# Altium schematic sheet ADC_Sheet.SchDoc
size A4
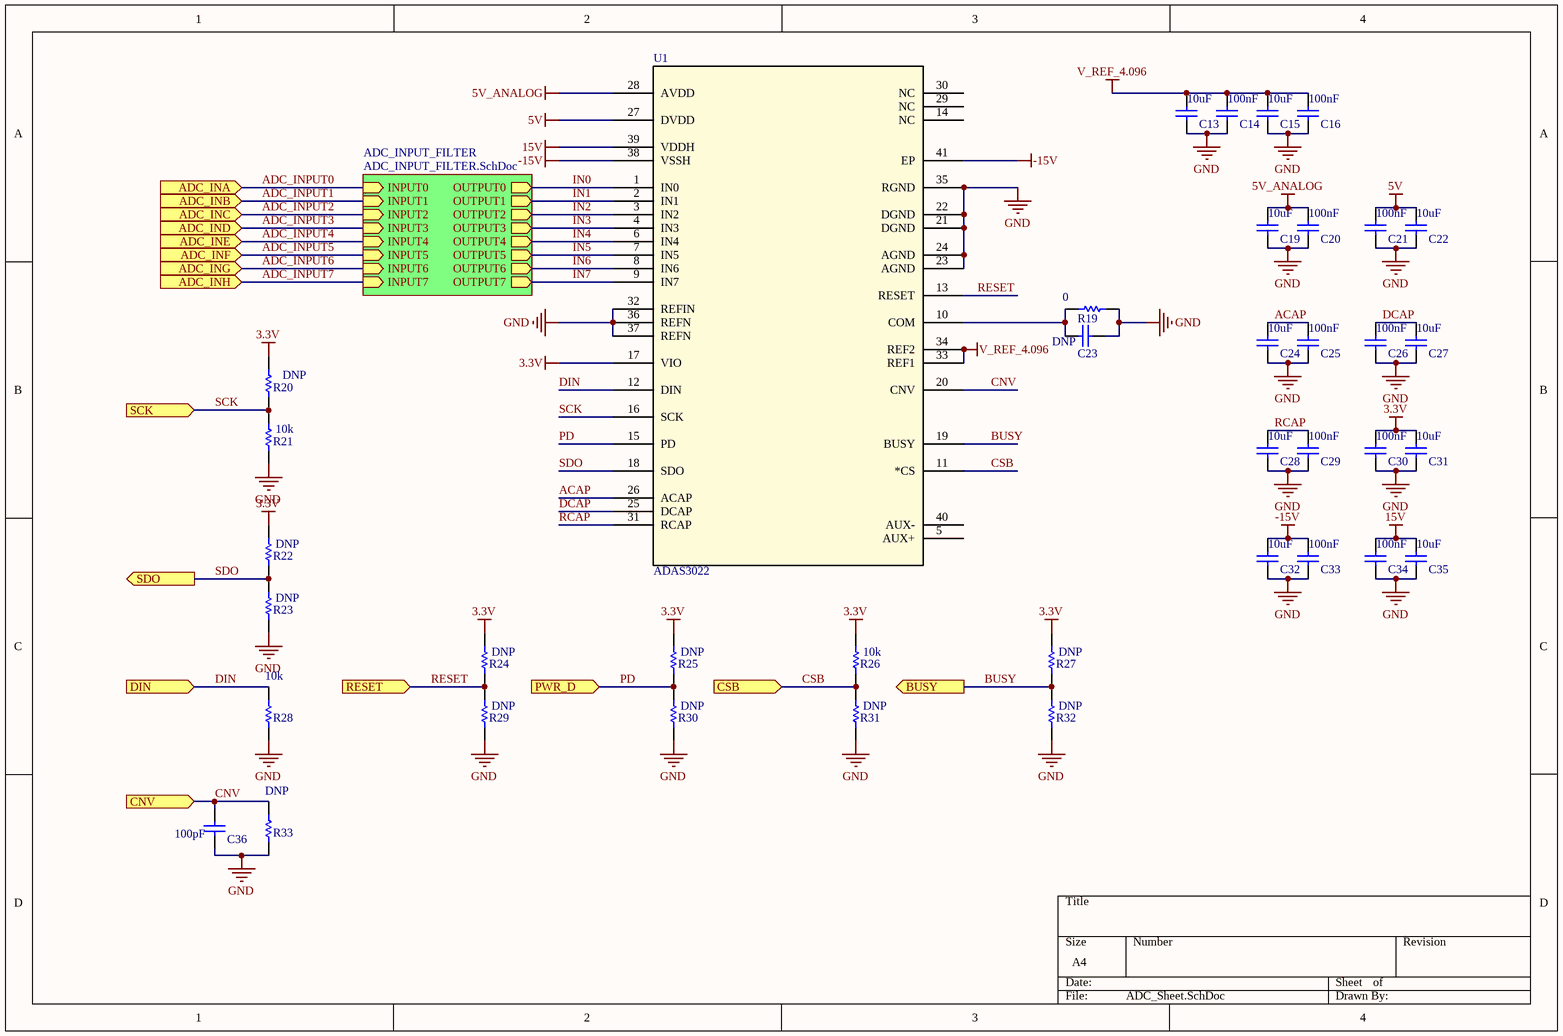
[diagram p0: ADC_Sheet.SchDoc]

## Parts
C13  value 10uF  [CAPC0805(2012)145_L]  (hidden comment: CAP0805)
C14  value 100nF  [CAPC0402(1005)60_L]  (hidden comment: CAP0402)
C15  value 10uF  [CAPC0805(2012)145_L]  (hidden comment: CAP0805)
C16  value 100nF  [CAPC0402(1005)60_L]  (hidden comment: CAP0402)
C19  value 10uF  [CAPC0805(2012)145_L]  (hidden comment: CAP0805)
C20  value 100nF  [CAPC0402(1005)60_L]  (hidden comment: CAP0402)
C21  value 100nF  [CAPC0402(1005)60_L]  (hidden comment: CAP0402)
C22  value 10uF  [CAPC0805(2012)145_L]  (hidden comment: CAP0805)
C23  value DNP  [CAPC0402(1005)60_L]  (hidden comment: CAP0402)
C24  value 10uF  [CAPC0805(2012)145_L]  (hidden comment: CAP0805)
C25  value 100nF  [CAPC0402(1005)60_L]  (hidden comment: CAP0402)
C26  value 100nF  [CAPC0402(1005)60_L]  (hidden comment: CAP0402)
C27  value 10uF  [CAPC0805(2012)145_L]  (hidden comment: CAP0805)
C28  value 10uF  [CAPC0805(2012)145_L]  (hidden comment: CAP0805)
C29  value 100nF  [CAPC0402(1005)60_L]  (hidden comment: CAP0402)
C30  value 100nF  [CAPC0402(1005)60_L]  (hidden comment: CAP0402)
C31  value 10uF  [CAPC0805(2012)145_L]  (hidden comment: CAP0805)
C32  value 10uF  [CAPC0805(2012)145_L]  (hidden comment: CAP0805)
C33  value 100nF  [CAPC0402(1005)60_L]  (hidden comment: CAP0402)
C34  value 100nF  [CAPC0402(1005)60_L]  (hidden comment: CAP0402)
C35  value 10uF  [CAPC0805(2012)145_L]  (hidden comment: CAP0805)
C36  value 100pF  [CAPC0402(1005)60_L]  (hidden comment: CAP0402)
R19  value 0  [RESC0402(1005)_L]  (hidden comment: RES0402)
R20  value DNP  [RESC0402(1005)_L]  (hidden comment: RES0402)
R21  value 10k  [RESC0402(1005)_L]  (hidden comment: RES0402)
R22  value DNP  [RESC0402(1005)_L]  (hidden comment: RES0402)
R23  value DNP  [RESC0402(1005)_L]  (hidden comment: RES0402)
R24  value DNP  [RESC0402(1005)_L]  (hidden comment: RES0402)
R25  value DNP  [RESC0402(1005)_L]  (hidden comment: RES0402)
R26  value 10k  [RESC0402(1005)_L]  (hidden comment: RES0402)
R27  value DNP  [RESC0402(1005)_L]  (hidden comment: RES0402)
R28  value 10k  [RESC0402(1005)_L]  (hidden comment: RES0402)
R29  value DNP  [RESC0402(1005)_L]  (hidden comment: RES0402)
R30  value DNP  [RESC0402(1005)_L]  (hidden comment: RES0402)
R31  value DNP  [RESC0402(1005)_L]  (hidden comment: RES0402)
R32  value DNP  [RESC0402(1005)_L]  (hidden comment: RES0402)
R33  value DNP  [RESC0402(1005)_L]  (hidden comment: RES0402)
U1  ADAS3022  [CP_40_7]

## Sub-sheets
ADC_INPUT_FILTER = ADC_INPUT_FILTER.SchDoc: INPUT0 (in), INPUT1 (in), INPUT2 (in), INPUT3 (in), INPUT4 (in), INPUT5 (in), INPUT6 (in), INPUT7 (in), OUTPUT0 (out), OUTPUT1 (out), OUTPUT2 (out), OUTPUT3 (out), OUTPUT4 (out), OUTPUT5 (out), OUTPUT6 (out), OUTPUT7 (out)

## Ports
ADC_INA (in), ADC_INB (in), ADC_INC (in), ADC_IND (in), ADC_INE (in), ADC_INF (in), ADC_ING (in), ADC_INH (in), BUSY (out), CNV (in), CSB (in), DIN (in), PWR_D (in), RESET (in), SCK (in), SDO (out)

## Nets
3.3V: C30.1 C31.2 R20.1 R22.1 R24.1 R25.1 R26.1 R27.1 U1.17(VIO)
5V: C21.1 C22.2 U1.27(DVDD)
5V_ANALOG: C19.2 C20.1 U1.28(AVDD)
15V: C34.1 C35.2 U1.39(VDDH)
-15V: C32.2 C33.1 U1.38(VSSH) U1.41(EP)
GND: C13.1 C14.2 C15.1 C16.2 C19.1 C20.2 C21.2 C22.1 C23.1 C24.1 C25.2 C26.2 C27.1 C28.1 C29.2 C30.2 C31.1 C32.1 C33.2 C34.2 C35.1 C36.2 R19.1 R21.2 R23.2 R28.2 R29.2 R30.2 R31.2 R32.2 R33.2 U1.21(DGND) U1.22(DGND) U1.23(AGND) U1.24(AGND) U1.32(REFIN) U1.35(RGND) U1.36(REFN) U1.37(REFN)
V_REF_4.096: C13.2 C14.1 C15.2 C16.1 U1.33(REF1) U1.34(REF2)
ACAP: C24.2 C25.1 U1.26(ACAP)
ADC_INPUT0: port ADC_INA, sheet ADC_INPUT_FILTER/INPUT0
ADC_INPUT1: port ADC_INB, sheet ADC_INPUT_FILTER/INPUT1
ADC_INPUT2: port ADC_INC, sheet ADC_INPUT_FILTER/INPUT2
ADC_INPUT3: port ADC_IND, sheet ADC_INPUT_FILTER/INPUT3
ADC_INPUT4: port ADC_INE, sheet ADC_INPUT_FILTER/INPUT4
ADC_INPUT5: port ADC_INF, sheet ADC_INPUT_FILTER/INPUT5
ADC_INPUT6: port ADC_ING, sheet ADC_INPUT_FILTER/INPUT6
ADC_INPUT7: port ADC_INH, sheet ADC_INPUT_FILTER/INPUT7
BUSY: R27.2 R32.1 U1.19(BUSY) ; port BUSY
CNV: C36.1 R33.1 U1.20(CNV) ; port CNV
CSB: R26.2 R31.1 U1.11(*CS) ; port CSB
DCAP: C26.1 C27.2 U1.25(DCAP)
DIN: R28.1 U1.12(DIN) ; port DIN
IN0: U1.1(IN0) ; sheet ADC_INPUT_FILTER/OUTPUT0
IN1: U1.2(IN1) ; sheet ADC_INPUT_FILTER/OUTPUT1
IN2: U1.3(IN2) ; sheet ADC_INPUT_FILTER/OUTPUT2
IN3: U1.4(IN3) ; sheet ADC_INPUT_FILTER/OUTPUT3
IN4: U1.6(IN4) ; sheet ADC_INPUT_FILTER/OUTPUT4
IN5: U1.7(IN5) ; sheet ADC_INPUT_FILTER/OUTPUT5
IN6: U1.8(IN6) ; sheet ADC_INPUT_FILTER/OUTPUT6
IN7: U1.9(IN7) ; sheet ADC_INPUT_FILTER/OUTPUT7
PD: R25.2 R30.1 U1.15(PD) ; port PWR_D
RCAP: C28.2 C29.1 U1.31(RCAP)
RESET: R24.2 R29.1 U1.13(RESET) ; port RESET
SCK: R20.2 R21.1 U1.16(SCK) ; port SCK
SDO: R22.2 R23.1 U1.18(SDO) ; port SDO
NetC23_2: C23.2 R19.2 U1.10(COM)

Not connected (* = marked no-connect by the designer): U1 5(AUX+) 14(NC) 29(NC) 30(NC) 40(AUX-)

## Library data of the parts
C13 C15 C19 C22 C24 C27 C28 C31 C32 C35 = CMP-1590-00003-1: 0805 (2012 Metric) Chip Capacitor; Case-EIA: 0805; Case-Metric: 2012; PackageReference: CAPC0805(2012)145
C14 C16 C20 C21 C23 C25 C26 C29 C30 C33 C34 C36 = CMP-1590-00004-1: 0402 (1005 Metric) Chip Capacitor; Case-EIA: 0402; Case-Metric: 1005; PackageReference: CAPC0402(1005)60
R19-R33 = CMP-1591-00004-1: 0402 (1005 Metric) Chip Resistor; Case-EIA: 0402; Case-Metric: 1005; PackageReference: RESC0402(1005)
U1 = ADAS3022: Manufacturer: Analog Devices Inc.; Manufacturer Part Number: ADAS3022BCPZ; Number of Bits: 16; Sampling Rate (Per Second): 1M; Number of Inputs: 4, 8; Input Type: Differential, Single Ended; Data Interface: SPI; Configuration: MUX-PGA-ADC; Architecture: SAR; Reference Type: External, Internal; Voltage - Supply, Analog: 5V; Supplier 1: Digi-Key; RoHS: RoHS Compliant; Category: Integrated Circuits (ICs); Stock 1: 300; Pricing 1: 1=25.89, 10=23.878 (EUR); Packaging: Tray; Part Status: Active; Ratio - S/H:ADC: -; Voltage - Supply, Digital: 5V; Features: PGA, Temperature Sensor; Operating Temperature: -40°C ~ 85°C; Package / Case: 40-VFQFN Exposed Pad, CSP; Supplier Device Package: 40-LFCSP-VQ (6x6); Base Part Number: ADAS3022; ComponentLink1URL: http://www.analog.com/media/en/technical-documentation/data-sheets/ADAS3022.pdf; ComponentLink1Description: http://www.analog.com/media/en/technical-documentation/data-sheets/ADAS3022.pdf; Supplier Part Number 1: ADAS3022BCPZ-ND